# Altium project S6.PrjPcb
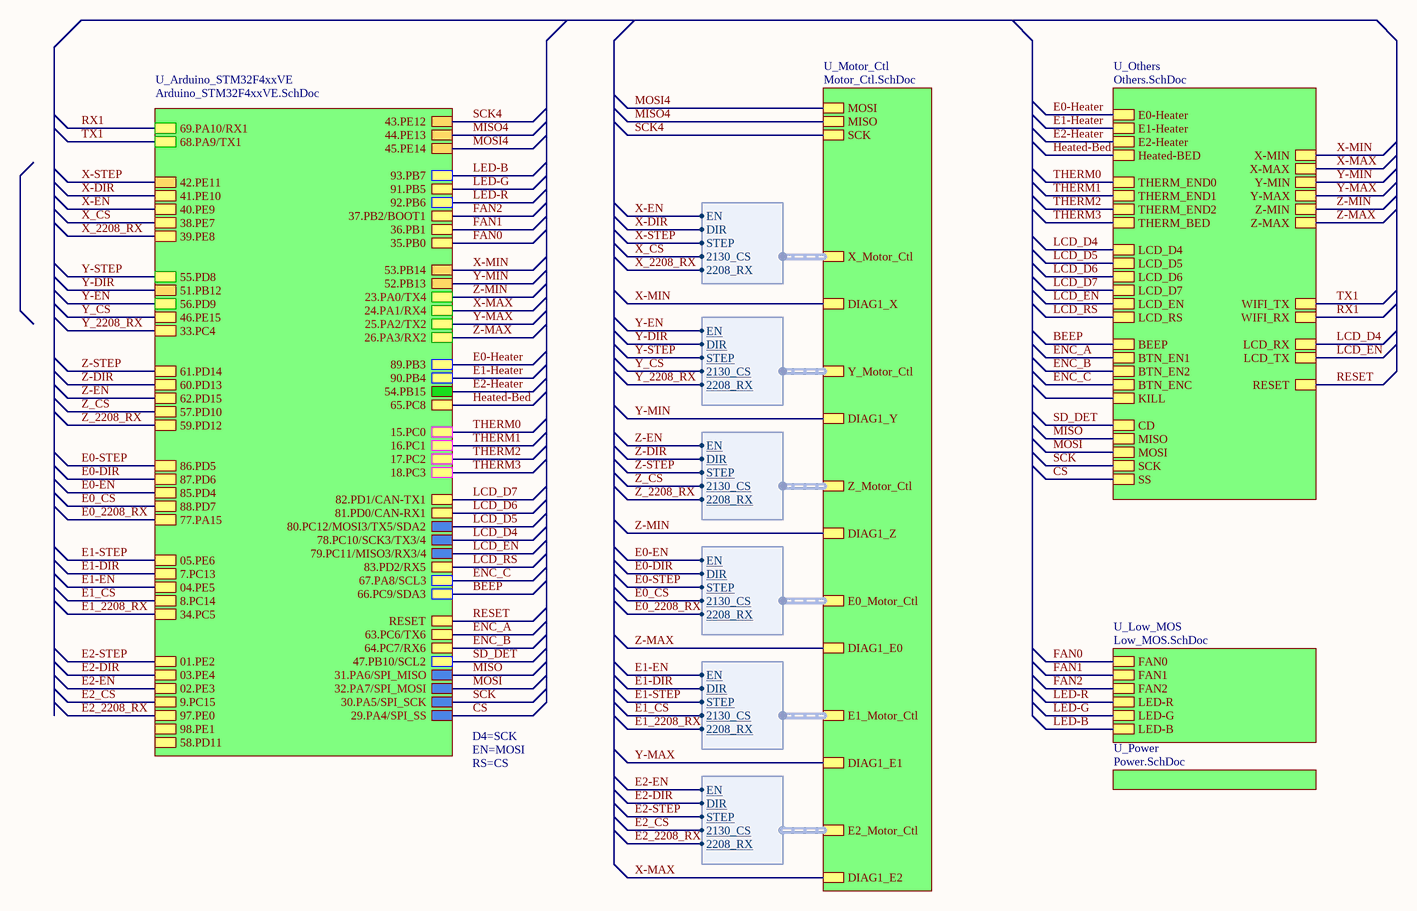
[diagram p0: S6.SchDoc]
3 sheets, 64 parts. Net scope: hierarchical (ports join the sheet entries above them; power ports are global).
Board file: S6 V2.0.PcbDoc
Sheets:
  S6.SchDoc
    U_Others = Others.SchDoc
  StepStick_Driver.SchDoc

## Sheet S6.SchDoc
size A3; DocumentNumber: 7; SheetNumber: 7; SheetTotal: 8

### Sub-sheets
U_Arduino_STM32F4xxVE = Arduino_STM32F4xxVE.SchDoc (file not in this document): 23.PA0/TX4, 24.PA1/RX4, 25.PA2/TX2, 26.PA3/RX2, 29.PA4/SPI_SS, 30.PA5/SPI_SCK, 31.PA6/SPI_MISO, 32.PA7/SPI_MOSI, 67.PA8/SCL3, 77.PA15, 35.PB0, 36.PB1, 37.PB2/BOOT1, 89.PB3, 90.PB4, 91.PB5, 92.PB6, 93.PB7, 47.PB10/SCL2, 51.PB12, 52.PB13, 53.PB14, 54.PB15, 15.PC0, 16.PC1, 17.PC2, 18.PC3, 33.PC4, 65.PC8, 66.PC9/SDA3, 7.PC13, 8.PC14, 9.PC15, 85.PD4, 86.PD5, 87.PD6, 88.PD7, 55.PD8, 56.PD9, 57.PD10, 58.PD11, 59.PD12, 60.PD13, 61.PD14, 62.PD15, 97.PE0, 98.PE1, 01.PE2, 02.PE3, 03.PE4, 04.PE5, 05.PE6, 38.PE7, 39.PE8, 40.PE9, 34.PC5, 68.PA9/TX1, 69.PA10/RX1, RESET, 41.PE10, 42.PE11, 43.PE12, 44.PE13, 45.PE14, 46.PE15, 79.PC11/MISO3/RX3/4, 63.PC6/TX6, 81.PD0/CAN-RX1, 83.PD2/RX5, 78.PC10/SCK3/TX3/4, 64.PC7/RX6, 80.PC12/MOSI3/TX5/SDA2, 82.PD1/CAN-TX1
U_Low_MOS = Low_MOS.SchDoc (file not in this document): FAN0, FAN1, FAN2, LED-R, LED-G, LED-B
U_Motor_Ctl = Motor_Ctl.SchDoc (file not in this document): MOSI, MISO, SCK, X_Motor_Ctl (harness Motor), E0_Motor_Ctl (harness Motor), E2_Motor_Ctl (harness Motor), E1_Motor_Ctl (harness Motor), Z_Motor_Ctl (harness Motor), Y_Motor_Ctl (harness Motor), DIAG1_X, DIAG1_Y, DIAG1_Z, DIAG1_E2, DIAG1_E0, DIAG1_E1
U_Others = Others.SchDoc: Heated-BED, THERM_BED, X-MIN, X-MAX, Y-MIN, Y-MAX, Z-MIN, Z-MAX, BTN_ENC, LCD_RS, LCD_D5, LCD_D7, BEEP, LCD_EN, LCD_D4, LCD_D6, CD, BTN_EN2, BTN_EN1, MISO, KILL, MOSI, SS, SCK, E1-Heater, THERM_END2, E2-Heater, THERM_END1, E0-Heater, THERM_END0, RESET, LCD_RX, LCD_TX, WIFI_RX, WIFI_TX
U_Power = Power.SchDoc (file not in this document): no entries

### Harnesses
Motor: EN, DIR, STEP, 2130_CS, 2208_RX

### Nets
BEEP: sheet U_Others/BEEP, sheet U_Arduino_STM32F4xxVE/66.PC9/SDA3
CS: sheet U_Others/SS, sheet U_Arduino_STM32F4xxVE/29.PA4/SPI_SS
E0-DIR: sheet U_Arduino_STM32F4xxVE/87.PD6, sheet U_Motor_Ctl/E0_Motor_Ctl.DIR
E0-EN: sheet U_Arduino_STM32F4xxVE/85.PD4, sheet U_Motor_Ctl/E0_Motor_Ctl.EN
E0-Heater: sheet U_Others/E0-Heater, sheet U_Arduino_STM32F4xxVE/89.PB3
E0-STEP: sheet U_Arduino_STM32F4xxVE/86.PD5, sheet U_Motor_Ctl/E0_Motor_Ctl.STEP
E0_2208_RX: sheet U_Arduino_STM32F4xxVE/77.PA15, sheet U_Motor_Ctl/E0_Motor_Ctl.2208_RX
E0_CS: sheet U_Arduino_STM32F4xxVE/88.PD7, sheet U_Motor_Ctl/E0_Motor_Ctl.2130_CS
E1-DIR: sheet U_Arduino_STM32F4xxVE/7.PC13, sheet U_Motor_Ctl/E1_Motor_Ctl.DIR
E1-EN: sheet U_Arduino_STM32F4xxVE/04.PE5, sheet U_Motor_Ctl/E1_Motor_Ctl.EN
E1-Heater: sheet U_Others/E1-Heater, sheet U_Arduino_STM32F4xxVE/90.PB4
E1-STEP: sheet U_Arduino_STM32F4xxVE/05.PE6, sheet U_Motor_Ctl/E1_Motor_Ctl.STEP
E1_2208_RX: sheet U_Arduino_STM32F4xxVE/34.PC5, sheet U_Motor_Ctl/E1_Motor_Ctl.2208_RX
E1_CS: sheet U_Arduino_STM32F4xxVE/8.PC14, sheet U_Motor_Ctl/E1_Motor_Ctl.2130_CS
E2-DIR: sheet U_Arduino_STM32F4xxVE/03.PE4, sheet U_Motor_Ctl/E2_Motor_Ctl.DIR
E2-EN: sheet U_Arduino_STM32F4xxVE/02.PE3, sheet U_Motor_Ctl/E2_Motor_Ctl.EN
E2-Heater: sheet U_Others/E2-Heater, sheet U_Arduino_STM32F4xxVE/54.PB15
E2-STEP: sheet U_Arduino_STM32F4xxVE/01.PE2, sheet U_Motor_Ctl/E2_Motor_Ctl.STEP
E2_2208_RX: sheet U_Arduino_STM32F4xxVE/97.PE0, sheet U_Motor_Ctl/E2_Motor_Ctl.2208_RX
E2_CS: sheet U_Arduino_STM32F4xxVE/9.PC15, sheet U_Motor_Ctl/E2_Motor_Ctl.2130_CS
ENC_A: sheet U_Others/BTN_EN1, sheet U_Arduino_STM32F4xxVE/63.PC6/TX6
ENC_B: sheet U_Others/BTN_EN2, sheet U_Arduino_STM32F4xxVE/64.PC7/RX6
ENC_C: sheet U_Others/BTN_ENC, sheet U_Arduino_STM32F4xxVE/67.PA8/SCL3
FAN0: sheet U_Low_MOS/FAN0, sheet U_Arduino_STM32F4xxVE/35.PB0
FAN1: sheet U_Low_MOS/FAN1, sheet U_Arduino_STM32F4xxVE/36.PB1
FAN2: sheet U_Low_MOS/FAN2, sheet U_Arduino_STM32F4xxVE/37.PB2/BOOT1
Heated-Bed: sheet U_Others/Heated-BED, sheet U_Arduino_STM32F4xxVE/65.PC8
LCD_D4: sheet U_Others/LCD_D4, sheet U_Others/LCD_RX, sheet U_Arduino_STM32F4xxVE/78.PC10/SCK3/TX3/4
LCD_D5: sheet U_Others/LCD_D5, sheet U_Arduino_STM32F4xxVE/80.PC12/MOSI3/TX5/SDA2
LCD_D6: sheet U_Others/LCD_D6, sheet U_Arduino_STM32F4xxVE/81.PD0/CAN-RX1
LCD_D7: sheet U_Others/LCD_D7, sheet U_Arduino_STM32F4xxVE/82.PD1/CAN-TX1
LCD_EN: sheet U_Others/LCD_EN, sheet U_Others/LCD_TX, sheet U_Arduino_STM32F4xxVE/79.PC11/MISO3/RX3/4
LCD_RS: sheet U_Others/LCD_RS, sheet U_Arduino_STM32F4xxVE/83.PD2/RX5
LED-B: sheet U_Low_MOS/LED-B, sheet U_Arduino_STM32F4xxVE/93.PB7
LED-G: sheet U_Low_MOS/LED-G, sheet U_Arduino_STM32F4xxVE/91.PB5
LED-R: sheet U_Low_MOS/LED-R, sheet U_Arduino_STM32F4xxVE/92.PB6
MISO: sheet U_Others/MISO, sheet U_Arduino_STM32F4xxVE/31.PA6/SPI_MISO
MISO4: sheet U_Motor_Ctl/MISO, sheet U_Arduino_STM32F4xxVE/44.PE13
MOSI: sheet U_Others/MOSI, sheet U_Arduino_STM32F4xxVE/32.PA7/SPI_MOSI
MOSI4: sheet U_Motor_Ctl/MOSI, sheet U_Arduino_STM32F4xxVE/45.PE14
RESET: sheet U_Others/RESET, sheet U_Arduino_STM32F4xxVE/RESET
RX1: sheet U_Others/WIFI_RX, sheet U_Arduino_STM32F4xxVE/69.PA10/RX1
SCK: sheet U_Others/SCK, sheet U_Arduino_STM32F4xxVE/30.PA5/SPI_SCK
SCK4: sheet U_Motor_Ctl/SCK, sheet U_Arduino_STM32F4xxVE/43.PE12
SD_DET: sheet U_Others/CD, sheet U_Arduino_STM32F4xxVE/47.PB10/SCL2  [project net CD]
THERM0: sheet U_Others/THERM_END0, sheet U_Arduino_STM32F4xxVE/15.PC0
THERM1: sheet U_Others/THERM_END1, sheet U_Arduino_STM32F4xxVE/16.PC1
THERM2: sheet U_Others/THERM_END2, sheet U_Arduino_STM32F4xxVE/17.PC2
THERM3: sheet U_Others/THERM_BED, sheet U_Arduino_STM32F4xxVE/18.PC3
TX1: sheet U_Others/WIFI_TX, sheet U_Arduino_STM32F4xxVE/68.PA9/TX1
X-DIR: sheet U_Arduino_STM32F4xxVE/41.PE10, sheet U_Motor_Ctl/X_Motor_Ctl.DIR
X-EN: sheet U_Arduino_STM32F4xxVE/40.PE9, sheet U_Motor_Ctl/X_Motor_Ctl.EN
X-MAX: sheet U_Others/X-MAX, sheet U_Motor_Ctl/DIAG1_E2, sheet U_Arduino_STM32F4xxVE/24.PA1/RX4
X-MIN: sheet U_Others/X-MIN, sheet U_Motor_Ctl/DIAG1_X, sheet U_Arduino_STM32F4xxVE/53.PB14
X-STEP: sheet U_Arduino_STM32F4xxVE/42.PE11, sheet U_Motor_Ctl/X_Motor_Ctl.STEP
X_2208_RX: sheet U_Arduino_STM32F4xxVE/39.PE8, sheet U_Motor_Ctl/X_Motor_Ctl.2208_RX
X_CS: sheet U_Arduino_STM32F4xxVE/38.PE7, sheet U_Motor_Ctl/X_Motor_Ctl.2130_CS
Y-DIR: sheet U_Arduino_STM32F4xxVE/51.PB12, sheet U_Motor_Ctl/Y_Motor_Ctl.DIR
Y-EN: sheet U_Arduino_STM32F4xxVE/56.PD9, sheet U_Motor_Ctl/Y_Motor_Ctl.EN
Y-MAX: sheet U_Others/Y-MAX, sheet U_Motor_Ctl/DIAG1_E1, sheet U_Arduino_STM32F4xxVE/25.PA2/TX2
Y-MIN: sheet U_Others/Y-MIN, sheet U_Motor_Ctl/DIAG1_Y, sheet U_Arduino_STM32F4xxVE/52.PB13
Y-STEP: sheet U_Arduino_STM32F4xxVE/55.PD8, sheet U_Motor_Ctl/Y_Motor_Ctl.STEP
Y_2208_RX: sheet U_Arduino_STM32F4xxVE/33.PC4, sheet U_Motor_Ctl/Y_Motor_Ctl.2208_RX
Y_CS: sheet U_Arduino_STM32F4xxVE/46.PE15, sheet U_Motor_Ctl/Y_Motor_Ctl.2130_CS
Z-DIR: sheet U_Arduino_STM32F4xxVE/60.PD13, sheet U_Motor_Ctl/Z_Motor_Ctl.DIR
Z-EN: sheet U_Arduino_STM32F4xxVE/62.PD15, sheet U_Motor_Ctl/Z_Motor_Ctl.EN
Z-MAX: sheet U_Others/Z-MAX, sheet U_Motor_Ctl/DIAG1_E0, sheet U_Arduino_STM32F4xxVE/26.PA3/RX2
Z-MIN: sheet U_Others/Z-MIN, sheet U_Motor_Ctl/DIAG1_Z, sheet U_Arduino_STM32F4xxVE/23.PA0/TX4
Z-STEP: sheet U_Arduino_STM32F4xxVE/61.PD14, sheet U_Motor_Ctl/Z_Motor_Ctl.STEP
Z_2208_RX: sheet U_Arduino_STM32F4xxVE/59.PD12, sheet U_Motor_Ctl/Z_Motor_Ctl.2208_RX
Z_CS: sheet U_Arduino_STM32F4xxVE/57.PD10, sheet U_Motor_Ctl/Z_Motor_Ctl.2130_CS

### Notes on the sheet
- D4=SCK
- EN=MOSI
- RS=CS
- Title
- Size:
- Date:
- A3
- Number:
- Time:
- Revision:
- Sheet
- of
- File:

## Sheet Others.SchDoc: Others
size A4; ApprovedBy: Eli; CheckedBy: Eli; DrawnBy: Eli; Engineer: Eli; Organization: 富源盛电子科技有限公司; Address1: 深圳市龙华新区; Address2: 观澜街道科利邦工业园; Address3: B栋（宿舍楼）15楼; Address4: T: 159 8944 7740; DocumentNumber: 3; Revision: 1.0; SheetNumber: 3; SheetTotal: 8; Status: Final
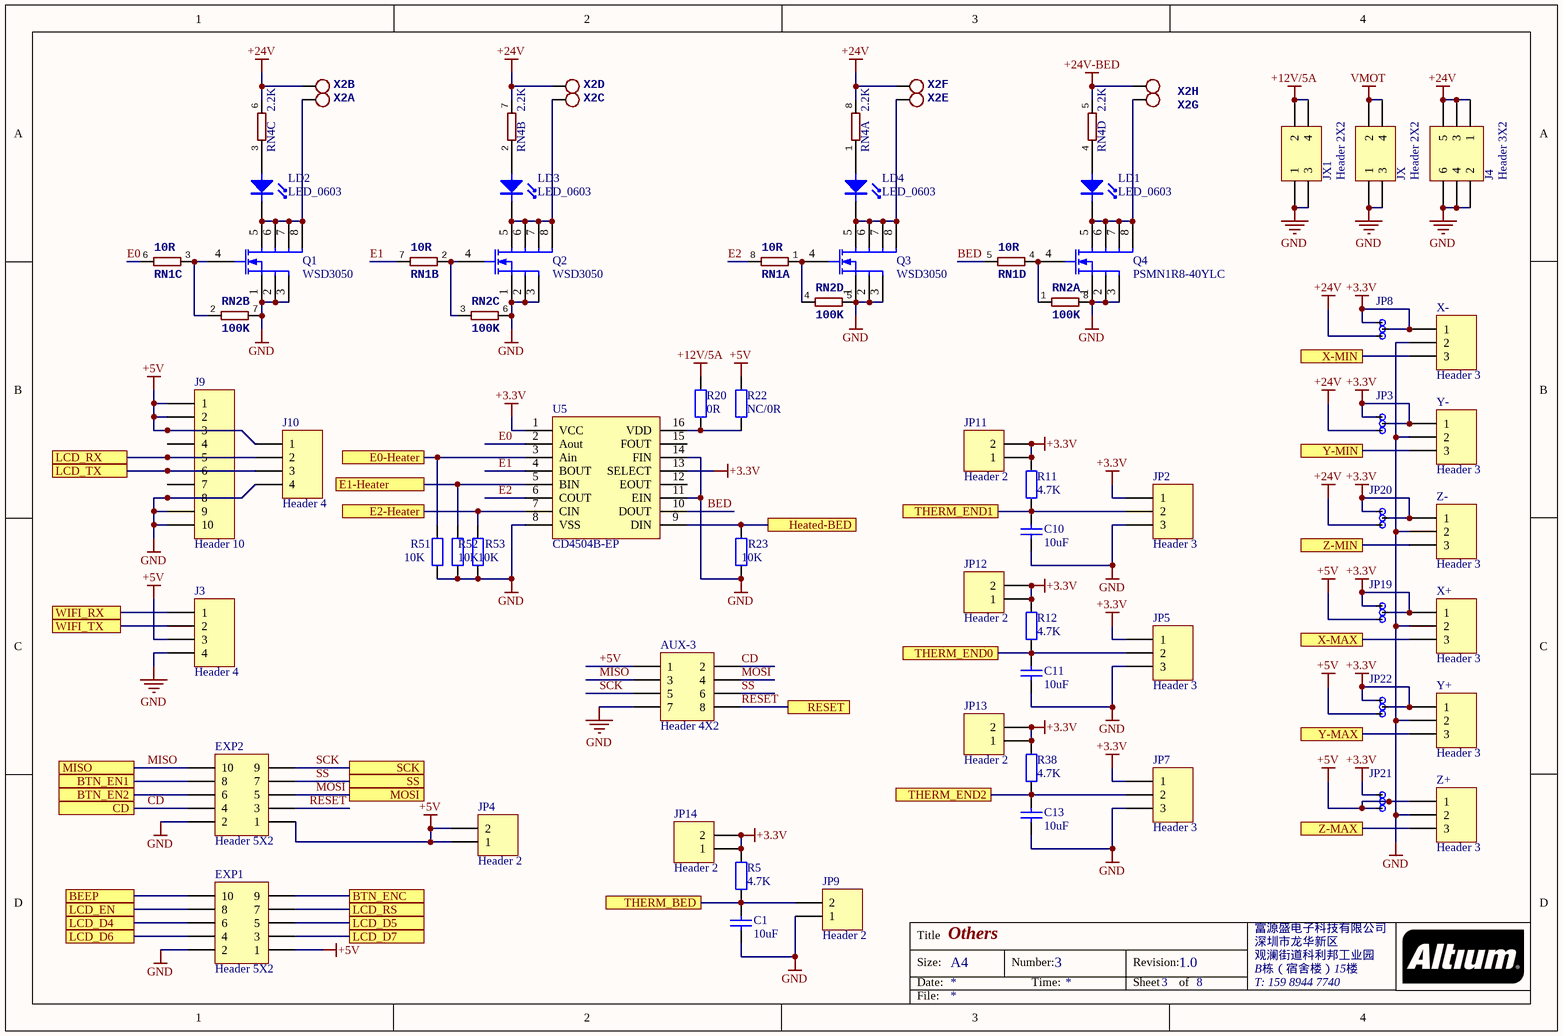
[diagram p1: Others.SchDoc]

### Parts
AUX-3  Header 4X2  [Header 2X4]
C1  10uF  [CAP0805]
C10  10uF  [CAP0805]
C11  10uF  [CAP0805]
C13  10uF  [CAP0805]
EXP1  Header 5X2  [CON-ML_ML10]
EXP2  Header 5X2  [CON-ML_ML10]
J3  Header 4  [1x4 MTE Straight Header 2.54mm]
J4  Header 3X2  [header 2X3]
J9  Header 10  [1.0mm_掀盖FPC]
J10  Header 4  [XH2.54-4P-L]
JP2  Header 3  [1X3 MTE STRAIGHT HEADER 2.54MM]
JP3  Jumper-3P  [PAD-JUMPER-3-2OF3_NC_BY_PASTE_YES_SILK_FULL_BOX]  (value not drawn)
JP4  Header 2  [Jumper2]
JP5  Header 3  [1X3 MTE STRAIGHT HEADER 2.54MM]
JP7  Header 3  [1X3 MTE STRAIGHT HEADER 2.54MM]
JP8  Jumper-3P  [PAD-JUMPER-3-2OF3_NC_BY_PASTE_YES_SILK_FULL_BOX]  (value not drawn)
JP9  Header 2  [1X2 MTE STRAIGHT HEADER 2.54MM]
JP11  Header 2  [Jumper2]
JP12  Header 2  [Jumper2]
JP13  Header 2  [Jumper2]
JP14  Header 2  [Jumper2]
JP19  Jumper-3P  [PAD-JUMPER-3-2OF3_NC_BY_PASTE_YES_SILK_FULL_BOX]  (value not drawn)
JP20  Jumper-3P  [PAD-JUMPER-3-2OF3_NC_BY_PASTE_YES_SILK_FULL_BOX]  (value not drawn)
JP21  Jumper-3P  [PAD-JUMPER-3-2OF3_NC_BY_PASTE_YES_SILK_FULL_BOX]  (value not drawn)
JP22  Jumper-3P  [PAD-JUMPER-3-2OF3_NC_BY_PASTE_YES_SILK_FULL_BOX]  (value not drawn)
JX  Header 2X2  [Header 2X2]
JX1  Header 2X2  [Header 2X2]
LD1  LED_0603  [LED0603]
LD2  LED_0603  [LED0603]
LD3  LED_0603  [LED0603]
LD4  LED_0603  [LED0603]
Q1  WSD3050  [DFN3X3-8L]
Q2  WSD3050  [DFN3X3-8L]
Q3  WSD3050  [DFN3X3-8L]
Q4  PSMN1R8-40YLC  [NXP_LFPAK56]
R5  4.7K  [RES0603]
R11  4.7K  [RES0603]
R12  4.7K  [RES0603]
R20  0R  [RES0603]
R22  NC/0R  [RES0603]
R23  10K  [RES0603]
R38  4.7K  [RES0603]
R51  10K  [RES0603]
R52  10K  [RES0603]
R53  10K  [RES0603]
RN1  10R  [RESISTOR-DIL_CAY16]  (parts A,B,C,D of 4)
RN2  100K  [RESISTOR-DIL_CAY16]  (parts A,B,C,D of 4)
RN4  2.2K  [RESISTOR-DIL_CAY16]  (parts A,B,C,D of 4)
U5  CD4504B-EP  [SSOP16]
X2  5.08-12P  [CON-PHOENIX-508_MKDSN1,5/12-5,08]  (value not drawn)  (parts A,B,C,D,E,F,G,H of 12)
X+  Header 3  [1x3 MTE Straight Header 2.54mm]
X-  Header 3  [1x3 MTE Straight Header 2.54mm]
Y+  Header 3  [1x3 MTE Straight Header 2.54mm]
Y-  Header 3  [1x3 MTE Straight Header 2.54mm]
Z+  Header 3  [1x3 MTE Straight Header 2.54mm]
Z-  Header 3  [1x3 MTE Straight Header 2.54mm]

### Ports
BEEP, BTN_EN1, BTN_EN2, BTN_ENC, CD, E0-Heater, E1-Heater, E2-Heater, Heated-BED, LCD_D4, LCD_D5, LCD_D6, LCD_D7, LCD_EN, LCD_RS, LCD_RX, LCD_TX, MISO, MOSI, RESET, SCK, SS, THERM_BED, THERM_END0, THERM_END1, THERM_END2, WIFI_RX, WIFI_TX, X-MAX, X-MIN, Y-MAX, Y-MIN, Z-MAX, Z-MIN

### Nets
+3.3V: JP2.1 JP3.1 JP3.2 JP5.1 JP7.1 JP8.1 JP8.2 JP11.1 JP11.2 JP12.1 JP12.2 JP13.1 JP13.2 JP14.1 JP14.2 JP19.1 JP19.2 JP20.1 JP20.2 JP21.1 JP22.1 JP22.2 R5.2 R11.2 R12.2 R38.2 U5.1(VCC) U5.13(SELECT) X+.1 X-.1 Y+.1 Y-.1 Z-.1
+5V: AUX-3.1 EXP1.1 EXP2.1 J3.3 J9.1 J9.2 J9.3 J10.1 JP4.1 JP4.2 JP19.3 JP21.2 JP21.3 JP22.3 R22.1 Z+.1
+12V/5A: JX1.2 JX1.4 R20.1
+24V: J4.1 J4.3 J4.5 JP3.3 JP8.3 JP20.3 RN4.6 RN4.7 RN4.8 X2.2(KL) X2.4(KL) X2.6(KL)
+24V-BED: RN4.5 X2.8(KL)
GND: AUX-3.7 C1.1 C10.1 C11.1 C13.1 EXP1.2 EXP2.2 J3.4 J4.2 J4.4 J4.6 J9.8 J9.9 J9.10 J10.4 JP2.3 JP5.3 JP7.3 JP9.1 JX.1 JX.3 JX1.1 JX1.3 Q1.1(S) Q1.2(S) Q1.3(S) Q2.1(S) Q2.2(S) Q2.3(S) Q3.1(S) Q3.2(S) Q3.3(S) Q4.1(S) Q4.2(S) Q4.3(S) R23.2 R51.2 R52.2 R53.2 RN2.5 RN2.6 RN2.7 RN2.8 U5.8(VSS) U5.11(EIN) U5.14(FIN) X+.2 X-.2 Y+.2 Y-.2 Z+.2 Z-.2
VMOT: JX.2 JX.4
BED: RN1.5 U5.10(DOUT)
BEEP: EXP1.10 ; port BEEP
CD: AUX-3.2 EXP2.4 ; port CD
E0: RN1.6 U5.2(Aout)
E0-Heater: R51.1 U5.3(Ain) ; port E0-Heater
E1: RN1.7 U5.4(BOUT)
E1-Heater: R52.1 U5.5(BIN) ; port E1-Heater
E2: RN1.8 U5.6(COUT)
E2-Heater: R53.1 U5.7(CIN) ; port E2-Heater
ENC_A: EXP2.8 ; port BTN_EN1
ENC_B: EXP2.6 ; port BTN_EN2
ENC_C: EXP1.9 ; port BTN_ENC
Heated-Bed: R23.1 U5.9(DIN) ; port Heated-BED
LCD_D4: EXP1.6 J9.5 J10.2 ; port LCD_D4, port LCD_RX
LCD_D5: EXP1.5 ; port LCD_D5
LCD_D6: EXP1.4 ; port LCD_D6
LCD_D7: EXP1.3 ; port LCD_D7
LCD_EN: EXP1.8 J9.6 J10.3 ; port LCD_EN, port LCD_TX
LCD_RS: EXP1.7 ; port LCD_RS
MISO: AUX-3.3 EXP2.10 ; port MISO
MOSI: AUX-3.4 EXP2.5 ; port MOSI
RESET: AUX-3.8 EXP2.3 ; port RESET
RX1: J3.1 ; port WIFI_RX
SCK: AUX-3.5 EXP2.9 ; port SCK
SS: AUX-3.6 EXP2.7 ; port SS  [project net CS]
THERM0: C11.2 JP5.2 R12.1 ; port THERM_END0
THERM1: C10.2 JP2.2 R11.1 ; port THERM_END1
THERM2: C13.2 JP7.2 R38.1 ; port THERM_END2
THERM3: C1.2 JP9.2 R5.1 ; port THERM_BED
TX1: J3.2 ; port WIFI_TX
X-MAX: X+.3 ; port X-MAX
X-MIN: X-.3 ; port X-MIN
Y-MAX: Y+.3 ; port Y-MAX
Y-MIN: Y-.3 ; port Y-MIN
Z-MAX: Z+.3 ; port Z-MAX
Z-MIN: Z-.3 ; port Z-MIN
NetLD1_1: LD1.1(A) Q4.5(D) Q4.6(D) Q4.7(D) Q4.8(D) X2.7(KL)
NetLD1_2: LD1.2(K) RN4.4
NetLD2_1: LD2.1(A) Q1.5(D) Q1.6(D) Q1.7(D) Q1.8(D) X2.1(KL)
NetLD2_2: LD2.2(K) RN4.3
NetLD3_1: LD3.1(A) Q2.5(D) Q2.6(D) Q2.7(D) Q2.8(D) X2.3(KL)
NetLD3_2: LD3.2(K) RN4.2
NetLD4_1: LD4.1(A) Q3.5(D) Q3.6(D) Q3.7(D) Q3.8(D) X2.5(KL)
NetLD4_2: LD4.2(K) RN4.1
NetQ1_4: Q1.4(G) RN1.3 RN2.2
NetQ2_4: Q2.4(G) RN1.2 RN2.3
NetQ3_4: Q3.4(G) RN1.1 RN2.4
NetQ4_4: Q4.4(G) RN1.4 RN2.1
NetR20_2: R20.2 R22.2 U5.16(VDD)

Not connected (* = marked no-connect by the designer): J9 4 7; U5 12(EOUT) 15(FOUT)

### Notes on the sheet
- Title
- Size:
- Date:
- A4
- Number:
- Time:
- Revision:
- Sheet
- of
- File:

### Library data of the parts
AUX-3 = Header 4X2: Header, 4-Pin, Dual row; LatestRevisionDate: 17-Jul-2002; LatestRevisionNote: Re-released for DXP Platform.; Publisher: Altium Limited
C1 C10 C11 C13 = Library_CAP-0008: RO C0G 22pF 2% 50V  0603; Faber ItemCode: 35321100; ID: Library_CAP-0008; Value: 10uF
EXP1 EXP2 = Header 5X2: Header, 5-Pin, Dual row; LatestRevisionDate: 17-Jul-2002; LatestRevisionNote: Re-released for DXP Platform.; Publisher: Altium Limited
J3 J10 = Header 4: Header, 4-Pin; LatestRevisionDate: 17-Jul-2002; LatestRevisionNote: Re-released for DXP Platform.; Publisher: Altium Limited
J4 = Header 3X2: Header, 3-Pin, Dual row; LatestRevisionDate: 17-Jul-2002; LatestRevisionNote: Re-released for DXP Platform.; Publisher: Altium Limited
J9 = Header 10: Header, 10-Pin; LatestRevisionDate: 17-Jul-2002; LatestRevisionNote: Re-released for DXP Platform.; Publisher: Altium Limited
JP2 JP5 JP7 X+ X- Y+ Y- Z+ Z- = Header 3: Header, 3-Pin; LatestRevisionDate: 17-Jul-2002; LatestRevisionNote: Re-released for DXP Platform.; Publisher: Altium Limited
JP4 JP9 JP11-JP14 = Header 2: Header, 2-Pin; LatestRevisionDate: 17-Jul-2002; LatestRevisionNote: Re-released for DXP Platform.; Publisher: Altium Limited
JX JX1 = Header 2X2: Header, 2-Pin, Dual row; LatestRevisionDate: 17-Jul-2002; LatestRevisionNote: Re-released for DXP Platform.; Publisher: Altium Limited
Q1-Q4 = MOSFET-N-SO8: IRF8736PBF - MOSFET, N SO-8; Mfg: INTERNATIONAL RECTIFIER; ID: LIBRARY_FET-0002; Info: HEXFET Power MOSFET; Faber ItemCode: 36926000; Mfg code: IRF8736PBF; Value: IRF8736PBF
R5 R11 R12 R38 = Library_RES-0001: RO RES 10k0 1% 0,063W  0603; Faber ItemCode: 36084500; ID: Library_RES-0001; Info: Resistor; Value: 4.7K
R20 R22 R23 R51-R53 = Library_RES-0001: RO RES 10k0 1% 0,063W  0603; Faber ItemCode: 36084500; Value: 4.7K; ID: Library_RES-0001; Info: Resistor
RN1 RN2 RN4 = RESISTOR-DIL_4R-NCAT16: OC_FARNELL: unknown; OC_NEWARK: unknown
X2 = CON-PHOENIX-508_MKDSN1,5/12-5,08: MPN: SMKDSN1,5/10-5,08; OC_FARNELL: 1792913; OC_NEWARK: 70R0297

## Sheet StepStick_Driver.SchDoc: Motor_Driver
size A4; ApprovedBy: Eli; CheckedBy: Eli; DrawnBy: Eli; Engineer: Eli; Organization: 富源盛电子科技有限公司; Address1: 深圳市龙华新区; Address2: 观澜街道科利邦工业园; Address3: B栋（宿舍楼）15楼; Address4: T: 159 8944 7740; DocumentNumber: 5; Revision: 1.0; SheetNumber: 5; SheetTotal: 8; Status: Final
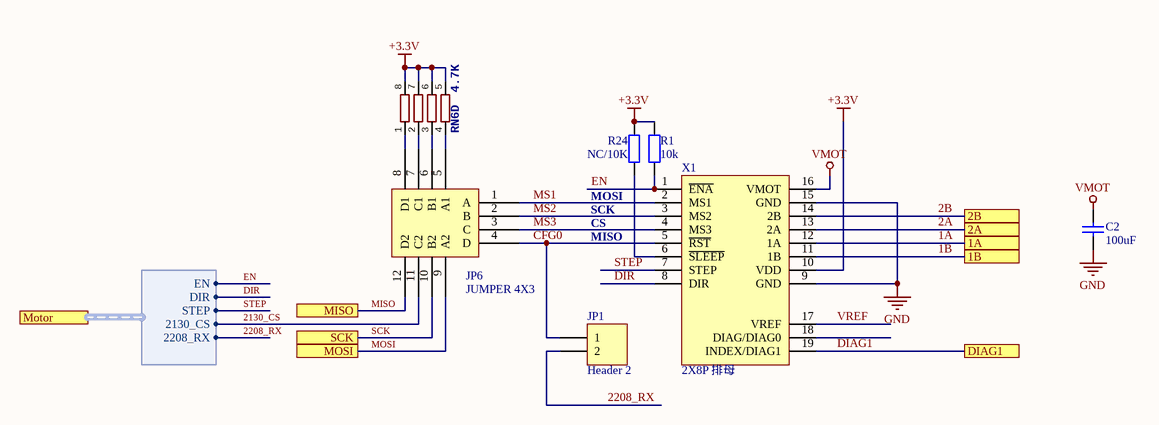
[diagram p2: StepStick_Driver.SchDoc]

### Parts
C2  100uF  [ELCO Case D]
JP1  Header 2  [HDR1X2]
JP6  JUMPER 4X3  [HEADER 3x4]
R1  10k  [RES0603]
R24  NC/10K  [RES0603]
RN6  4.7K  [RESISTOR-DIL_CAY16]  (value not drawn)  (parts A,B,C,D of 4)
X1  2X8P 排母  [TMC_breakout]

### Ports
1A, 1B, 2A, 2B, DIAG1, MISO, MOSI, Motor (harness Motor), SCK

### Harnesses
Motor: EN, DIR, STEP, 2130_CS, 2208_RX

### Nets
+3.3V: R1.2 R24.2 RN6.5 RN6.6 RN6.7 RN6.8 X1.10(VDD)
GND: C2.2 X1.9(GND) X1.15(GND)
VMOT: C2.1 X1.16(VMOT)
1A: X1.12(1A) ; port 1A
1B: X1.11(1B) ; port 1B
2A: X1.13(2A) ; port 2A
2B: X1.14(2B) ; port 2B
2130_CS: JP6.11(C2) ; port Motor.2130_CS
2208_RX: JP1.2 ; port Motor.2208_RX
CFG0: JP1.1 JP6.4(D) X1.5(~{RST})
DIAG1: X1.19(INDEX/DIAG1) ; port DIAG1
DIR: X1.8(DIR) ; port Motor.DIR
EN: R1.1 X1.1(~{ENA}) ; port Motor.EN
MISO: JP6.12(D2) ; port MISO
MOSI: JP6.9(A2) ; port MOSI
MS1: JP6.1(A) X1.2(MS1)
MS2: JP6.2(B) X1.3(MS2)
MS3: JP6.3(C) X1.4(MS3)
SCK: JP6.10(B2) ; port SCK
STEP: X1.7(STEP) ; port Motor.STEP
VREF: X1.17(VREF)
NetJP6_5: JP6.5(A1) RN6.4
NetJP6_6: JP6.6(B1) RN6.3
NetJP6_7: JP6.7(C1) RN6.2
NetJP6_8: JP6.8(D1) RN6.1
NetR24_1: R24.1 X1.6(~{SLEEP})

Not connected (* = marked no-connect by the designer): X1 18(DIAG/DIAG0)

### Notes on the sheet
- MOSI
- CS
- SCK
- MISO
- Title
- Size:
- Date:
- A4
- Number:
- Time:
- Revision:
- Sheet
- of
- File:

### Library data of the parts
C2 = Capacitor
JP1 = Header 2: Header, 2-Pin; LatestRevisionDate: 17-Jul-2002; LatestRevisionNote: Re-released for DXP Platform.; Publisher: Altium Limited
R1 = Resistor_2: RO RES 1k0 1% 0,1W  0603; ID: Library_RES-0004; Faber ItemCode: 34637900; Info: Resistor; Value: 10k
R24 = Resistor_2: RO RES 1k0 1% 0,1W  0603; ID: Library_RES-0004; Faber ItemCode: 34637900; Value: 10k; Info: Resistor
RN6 = RESISTOR-DIL_4R-NCAY16: OC_FARNELL: unknown; OC_NEWARK: unknown
X1 = TMC_BREAKOUT

## Nets that join several sheets
+3.3V: Others (33 pins), StepStick_Driver (7 pins)
GND: Others (52 pins), StepStick_Driver (C2.2 X1.9 X1.15)
VMOT: Others (JX.2 JX.4), StepStick_Driver (C2.1 X1.16)